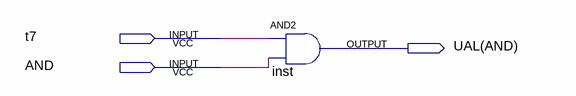
[diagram p0: schematic sheet]
// Quartus schematic UAL(AND).bdf as structural Verilog: 1 symbols, 3 pins
module \UAL(AND)  (
  input  t7,
  input  AND,
  output \UAL(AND) 
);

  and inst (\UAL(AND) , t7, AND);
endmodule
